# EAGLE design OFFWORLD-SWITCH_PCB (EAGLE 9.1.3)
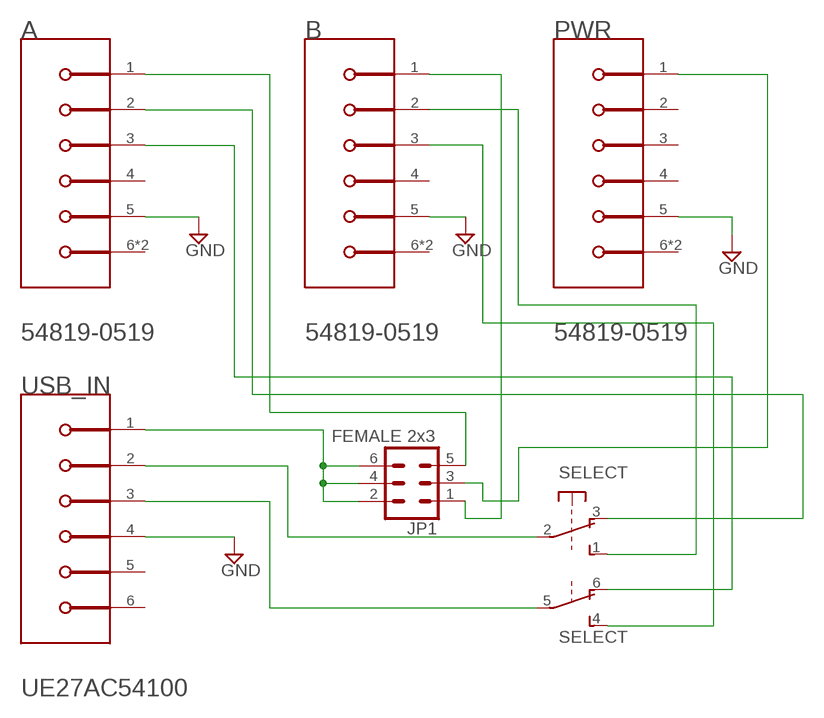
[diagram p0: schematic, sheet 1]

## Parts
A  MOLEX_54819-0519MOLEX_54819-0519_0_0  [MOLEX_54819-0519_0]
B  MOLEX_54819-0519MOLEX_54819-0519_0_0  [MOLEX_54819-0519_0]
JP1  FEMALE 2x3  CONN_03X2FEMALE  [2X3]
PWR  MOLEX_54819-0519MOLEX_54819-0519_0_0  [MOLEX_54819-0519_0]
SELECT  9450-2  [9450-2]
USB_IN  AMPHENOL_UE27AC54100AMPHENOL_UE27AC54100_0_0  [AMPHENOL_UE27AC54100_0]

## Nets
GND: A.5(GND) B.5(GND) PWR.5(GND) USB_IN.4
N$5: JP1.2 JP1.4 JP1.6 USB_IN.1
N$6: SELECT.2(1:P) USB_IN.2
N$7: SELECT.5(2:P) USB_IN.3
N$8: A.1(VBUS) JP1.5
N$9: JP1.3 PWR.1(VBUS)
N$10: B.1(VBUS) JP1.1
N$11: B.2(D-) SELECT.1(1:S)
N$12: B.3(D+) SELECT.4(2:S)
N$13: A.2(D-) SELECT.3(1:O)
N$14: A.3(D+) SELECT.6(2:O)
Unconnected: A.4(ID) A.6(GND_C) A.6-2(GND_C) B.4(ID) B.6(GND_C) B.6-2(GND_C) PWR.2(D-) PWR.3(D+) PWR.4(ID) PWR.6(GND_C) PWR.6-2(GND_C) USB_IN.5(MNT_1) USB_IN.6(MNT_2)

## Library data of the parts
A B PWR = Molex - 54819-0519:MOLEX_54819-0519: USB On-The-Go (OTG) Mini-B Receptacle, Right Angle, Through Hole Solder Tails and Shell Tabs, Lead-Free; CENTROID_NOT_SPECIFIED: No; DATASHEET: https://upverter.com/datasheet/9d71f2f8719b3fc0715bd6f9e6d9d5a5d296bb87.pdf; DIGIKEY_DESCRIPTION: CONN USB - mini B USB 2.0 OTG Receptacle Connector 5 Position Through Hole, Right Angle; DIGIKEY_PART_NUMBER: WM17115-ND; IS_FEMALE: yes; LEAD_FREE: yes; MF: Molex; MOUSER_PART_NUMBER: 538-54819-0519; MPN: 54819-0519; PACKAGE: CONN_PTH_7MM7_9MM0_USB; PREFIX: J; ROHS: yes; TEMPERATURE_RANGE_HIGH: +85°C; TEMPERATURE_RANGE_LOW: -20°C
JP1 = SparkFun-Connectors:CONN_03X2: Multi connection point. Often used as Generic Header-pin footprint for 0.1 inch spaced/style header connections You can populate with any combo of single row headers, but if you'd like an exact match, check these: Header - 2x3 (Male, 0.1") <https://www.sparkfun.com/products/12807> (PRT-12807) Header - 2x3 (Female, 0.1") <https://www.sparkfun.com/products/13010> (PRT-13010) 2x3 Pin Shrouded Header <https://www.sparkfun.com/products/10877> (PRT-10877) On any of the 0.1 inch spaced packages, you can populate with these: Break Away Headers - Straight <https://www.sparkfun.com/products/116> (PRT-00116) Break Away Male Headers - Right Angle <https://www.sparkfun.com/products/553> (PRT-00553) Female Headers <https://www.sparkfun.com/products/115> (PRT-00115) Break Away Headers - Machine Pin <https://www.sparkfun.com/products/117> (PRT-00117) Break Away Female Headers - Swiss Machine Pin <https://www.sparkfun.com/products/743> (PRT-00743) Special note: the shrouded connector mates well with our 3x2 ribbon cables: Ribbon Crimp Connector - 6-pin (2x3, Female) <https://www.sparkfun.com/products/10651> (PRT-10651) Ribbon Cable - 6 wire (15ft) <https://www.sparkfun.com/products/10646> (PRT-10646); PROD_ID: CONN-11566
SELECT = switch-misc:9450-2: MARQUARDT SWITCH
USB_IN = Amphenol - UE27AC54100:AMPHENOL_UE27AC54100: USB - A USB 2.0 Receptacle Connector 4 Position Through Hole, Right Angle; CENTROID_NOT_SPECIFIED: No; DATASHEET: https://www.amphenolcanada.com/ProductSearch/drawings/AC/UE27ACX4X0X.pdf; DIGIKEY_DESCRIPTION: CONN RCPT USB TYPE A R/A GOLD; DIGIKEY_PART_NUMBER: UE27AC54100-ND; IS_FEMALE: yes; LEAD_FREE: yes; MF: Amphenol; MOUSER_PART_NUMBER: 523-UE27-AC54-100; MPN: UE27AC54100; PACKAGE: CONN_USB_2.0; PREFIX: J; ROHS: yes; TEMPERATURE_RANGE_HIGH: +85°C; TEMPERATURE_RANGE_LOW: -40°C; VOLTAGE: 30V

## Board
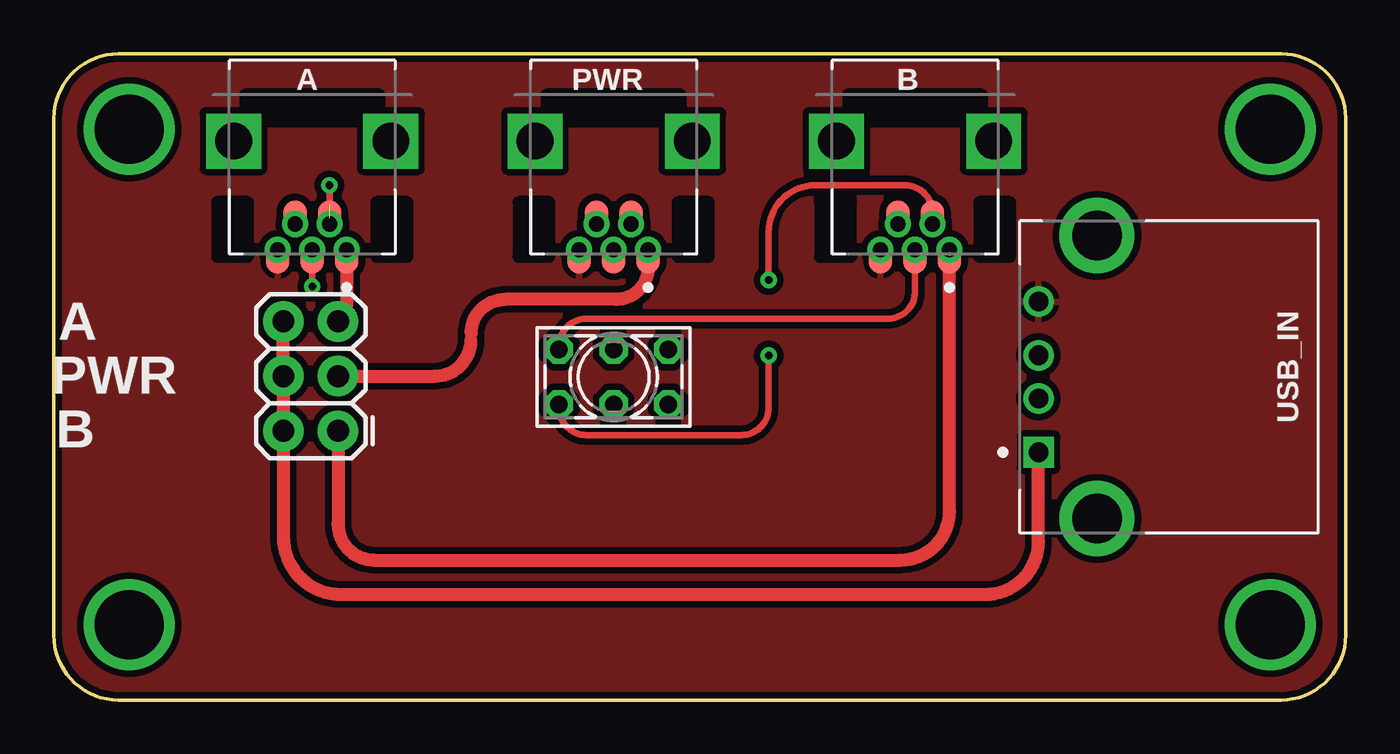
[diagram p1: board, top side]
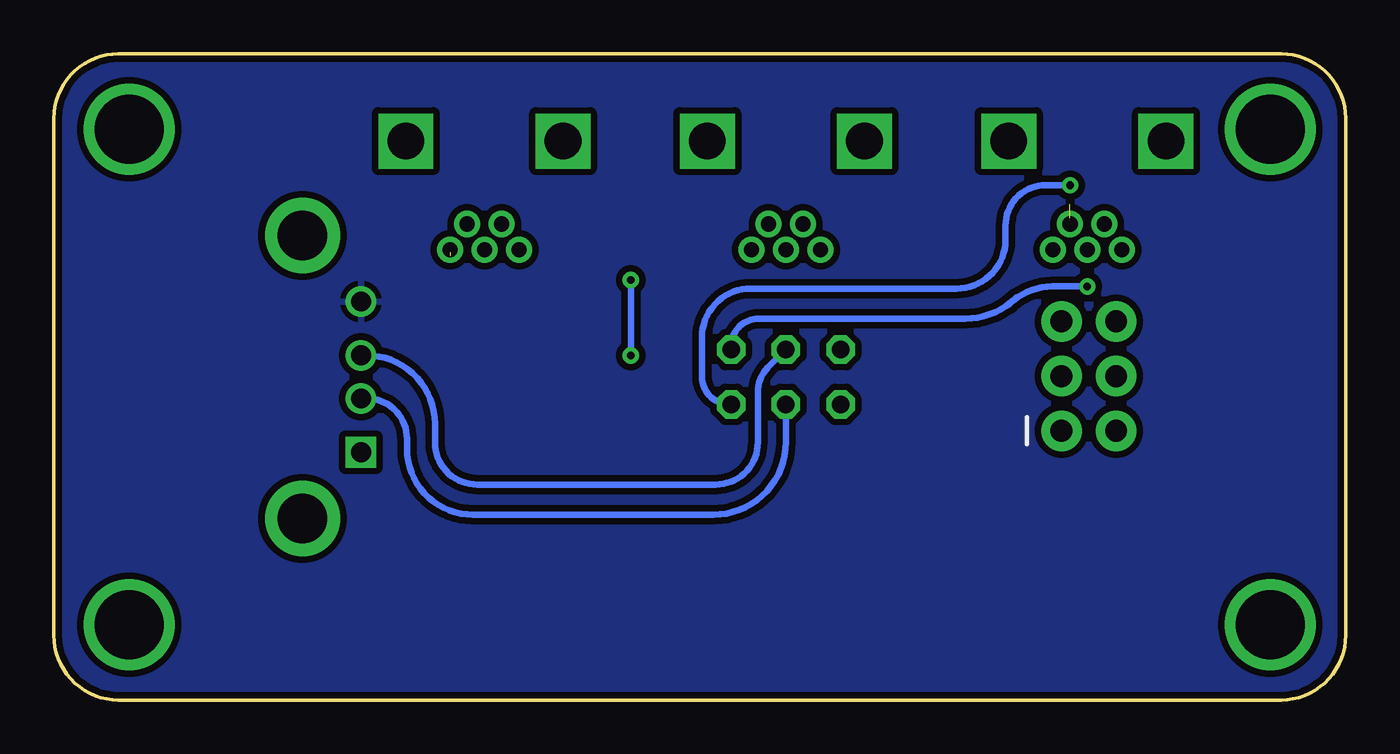
[diagram p2: board, bottom side, seen from below]

Size 60 x 30 mm. Coordinates in mm from the lower left corner, seen from the top.
Outline: 60,27 60,3 arc-90 57,0 3,0 arc-90 0,3 0,27 arc-90 3,30 14,30 57,30 arc-90 60,27
Copper layers (1*16): Top 0.035mm / dielectric 1.5mm / Bottom 0.035mm
Design rules "default *": minimum track width 6mil, minimum drill 0.35mm, track to track 6mil, track to pad 6mil, pad to pad 6mil, via to via 6mil, smd to smd 6mil, copper to edge 10mil, drill to drill 6mil, minimum pad ring 10mil, minimum via ring 8mil, stop-mask expansion 4mil, vias tented up to drill 0mil, thermal gap 10mil

### Footprints (pad centres in the part's own frame; a part is rotated, then mirrored left to right if it is on the bottom)
MOLEX_54819-0519_0 = smd 1.1 x 1.65: 1 -1.6,4.575; 2 -0.8,2.825; 3 0,4.575; 4 0.8,2.825; 5 1.6,4.575 | drill 1.7 pad 2.184 square: 6 -3.65,-0.75; 6-2 3.65,-0.75 | drill 0.7 pad 0.7: PAD_3 1.6,4.3; PAD_4 0.8,3.1; PAD_5 0,4.3; PAD_6 -0.8,3.1; PAD_7 -1.6,4.3
2X3 = drill 1.016 pad 1.88: 1 0,0; 2 0,2.54; 3 2.54,0; 4 2.54,2.54; 5 5.08,0; 6 5.08,2.54
9450-2 = drill 0.813 octagon: 1 -2.54,-1.27; 2 0,-1.27; 3 2.54,-1.27; 4 -2.54,1.27; 5 0,1.27; 6 2.54,1.27
AMPHENOL_UE27AC54100_0 = drill 0.92 pad 1.42 square: 1 -3.5,6.065 | drill 0.92 pad 1.42: 2 -1,6.065; 3 1,6.065; 4 3.5,6.065 | drill 2.3 pad 3.5: 5 -6.57,3.355; 6 6.57,3.355

### Placement (x,y rotation side)
A  12,25.2 180 top
B  40,25.2 180 top
JP1  13.2,12.5 90 top
PWR  26,25.2 180 top
SELECT  26,15 0 top
USB_IN  51.8,15 90 top

### Tracks (layer width: path | path; a pad name or v marks a point on that pad's centre or on a via)
GND
  pour Top (isolate 0.305): 2.67,29.9 57.33,29.9 arc-90 60,27.23 60,2.87 arc-90 57.23,0.1 2.37,0.1 arc-90 0.1,2.37 0.1,27.33 arc-90
  pour Bottom (isolate 0.305): 2.27,29.8 57.53,29.8 arc-90 59.9,27.43 59.9,2.87 arc-90 57.03,0 2.77,0 arc-90 0.1,2.67 0.1,27.63 arc-90
N$1  (via drill 3.2)
  other vias: 3.5,3.5
N$2  (via drill 3.2)
  other vias: 3.5,26.5
N$3  (via drill 3.2)
  other vias: 56.5,26.5
N$4  (via drill 3.2)
  other vias: 56.5,3.5
N$5
  Top 0.508: JP1.6 JP1.2
  Top 0.61: USB_IN.1 45.73,7.37 arc-90 43.27,4.9 13.33,4.9 arc-90 10.66,7.57 JP1.2 JP1.4 JP1.6
N$6
  Bottom 0.305: USB_IN.2 45.47,14 arc90 43.6,12.13 43.6,11.67 arc-90 40.53,8.6 29.37,8.6 arc-90 26,11.97 SELECT.2
N$7
  Bottom 0.305: USB_IN.3 45.47,16 arc90 42.3,12.83 42.3,11.97 arc-90 40.33,10 29.27,10 arc-90 27.3,11.97 27.3,14.3 arc45 26.83,15.44 SELECT.5
N$8
  Top 0.61: A.1 13.6,18.51 arc-45 13.23,17.61 JP1.5
N$9
  Top 0.508: 19.38,16.7 19.38,17.04
  Top 0.61: JP1.3 17.7,15.04 arc89 19.38,16.7 | 19.38,17.04 arc-89 20.96,18.6 26.13,18.6 arc90 27.6,20.07 PWR.1
N$10  (1 unrouted)
  Top 0.61: JP1.1 13.2,8.17 arc90 14.87,6.5 39.33,6.5 arc90 41.6,8.77 41.6,20.8
N$11  (via drill 0.35)
  Top 0.305: SELECT.1 23.46,13.57 arc90 24.73,12.3 31.93,12.3 arc90 33.2,13.57 v33.2,16 | v33.2,19.5 33.2,21.73 arc-90 35.37,23.9 39.53,23.9 arc-90 40.8,22.63 B.2
  Bottom 0.305: v33.2,16 v33.2,19.5
N$12
  Top 0.305: SELECT.4 23.46,16.43 arc-90 24.73,17.7 38.73,17.7 arc90 40,18.97 B.3
N$13  (via drill 0.35)  (1 unrouted)
  Top 0.305: v12.8,23.9 12.8,23.01
  Bottom 0.305: SELECT.3 28.63,13.73 arc90 29.9,15 29.9,16.83 arc90 27.63,19.1 18.07,19.1 arc-90 15.8,21.37 15.8,22.03 arc90 13.93,23.9 v12.8,23.9
N$14  (via drill 0.35)
  Top 0.305: A.3 v12,19.2
  Bottom 0.305: SELECT.6 28.54,16.43 arc90 27.27,17.7 17.9,17.7 17.68,17.7 arc-45 15.32,18.68 15.63,18.37 arc45 13.63,19.2 v12,19.2

### Text on the board
tNames: A | PWR | B